# EAGLE schematic E1AA60D5 (EAGLE 6.2)
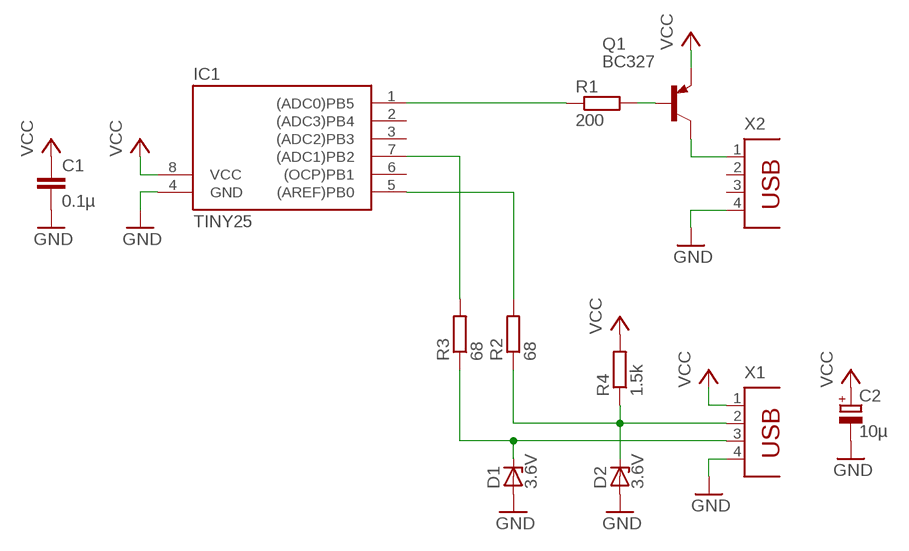
[diagram p0: schematic, sheet 1]

## Parts
C1  0.1µ  C-EU025-025X050  [C025-025X050]
C2  10µ  CPOL-EUE2.5-6  [E2,5-6]
D1  3.6V  ZENER-DIODEDO35Z10  [DO35Z10]
D2  3.6V  ZENER-DIODEDO35Z10  [DO35Z10]
IC1  TINY25  TINY15LP  [DIL08]
Q1  BC327  [TO92-EBC]
R1  200  R-EU_0207/10  [0207/10]
R2  68  R-EU_0207/10  [0207/10]
R3  68  R-EU_0207/10  [0207/10]
R4  1.5k  R-EU_0207/10  [0207/10]
X1  PN87520  [PN87520]
X2  PN87520  [PN87520]

## Nets
GND: C1.2 C2.- D1.A D2.A IC1.4(GND) X1.4 X2.4
N$1: IC1.1((ADC0)PB5) R1.1
N$2: Q1.C X2.1
N$3: Q1.B R1.2
N$4: D2.C R2.1 R4.1 X1.2
N$5: D1.C R3.1 X1.3
N$6: IC1.5((AREF)PB0) R2.2
N$7: IC1.7((ADC1)PB2) R3.2
VCC: C1.1 C2.+ IC1.8(VCC) Q1.E R4.2 X1.1
Unconnected: IC1.2((ADC3)PB4) IC1.3((ADC2)PB3) IC1.6((OCP)PB1) X2.2 X2.3

## Library data of the parts
C1 = resistor:C-EU: CAPACITOR, European symbol
C2 = resistor:CPOL-EU: POLARIZED CAPACITOR, European symbol
D1 D2 = diode:ZENER-DIODE: Z-Diode
IC1 = atmel:TINY15L: MICROCONTROLLER 2.7 V 1 Kbytes FLASH 64 bytes EEPROM 4-channel 10 bit ADC; OC_FARNELL: unknown; OC_NEWARK: unknown
Q1 = transistor-pnp:BC327*: PNP Transistror
R1-R4 = resistor:R-EU_: RESISTOR, European symbol
X1 X2 = con-berg:PN87520: BERG USB connector; OC_FARNELL: unknown; OC_NEWARK: unknown